# EAGLE design sensor_board_v0.55 (EAGLE 8.1.1)
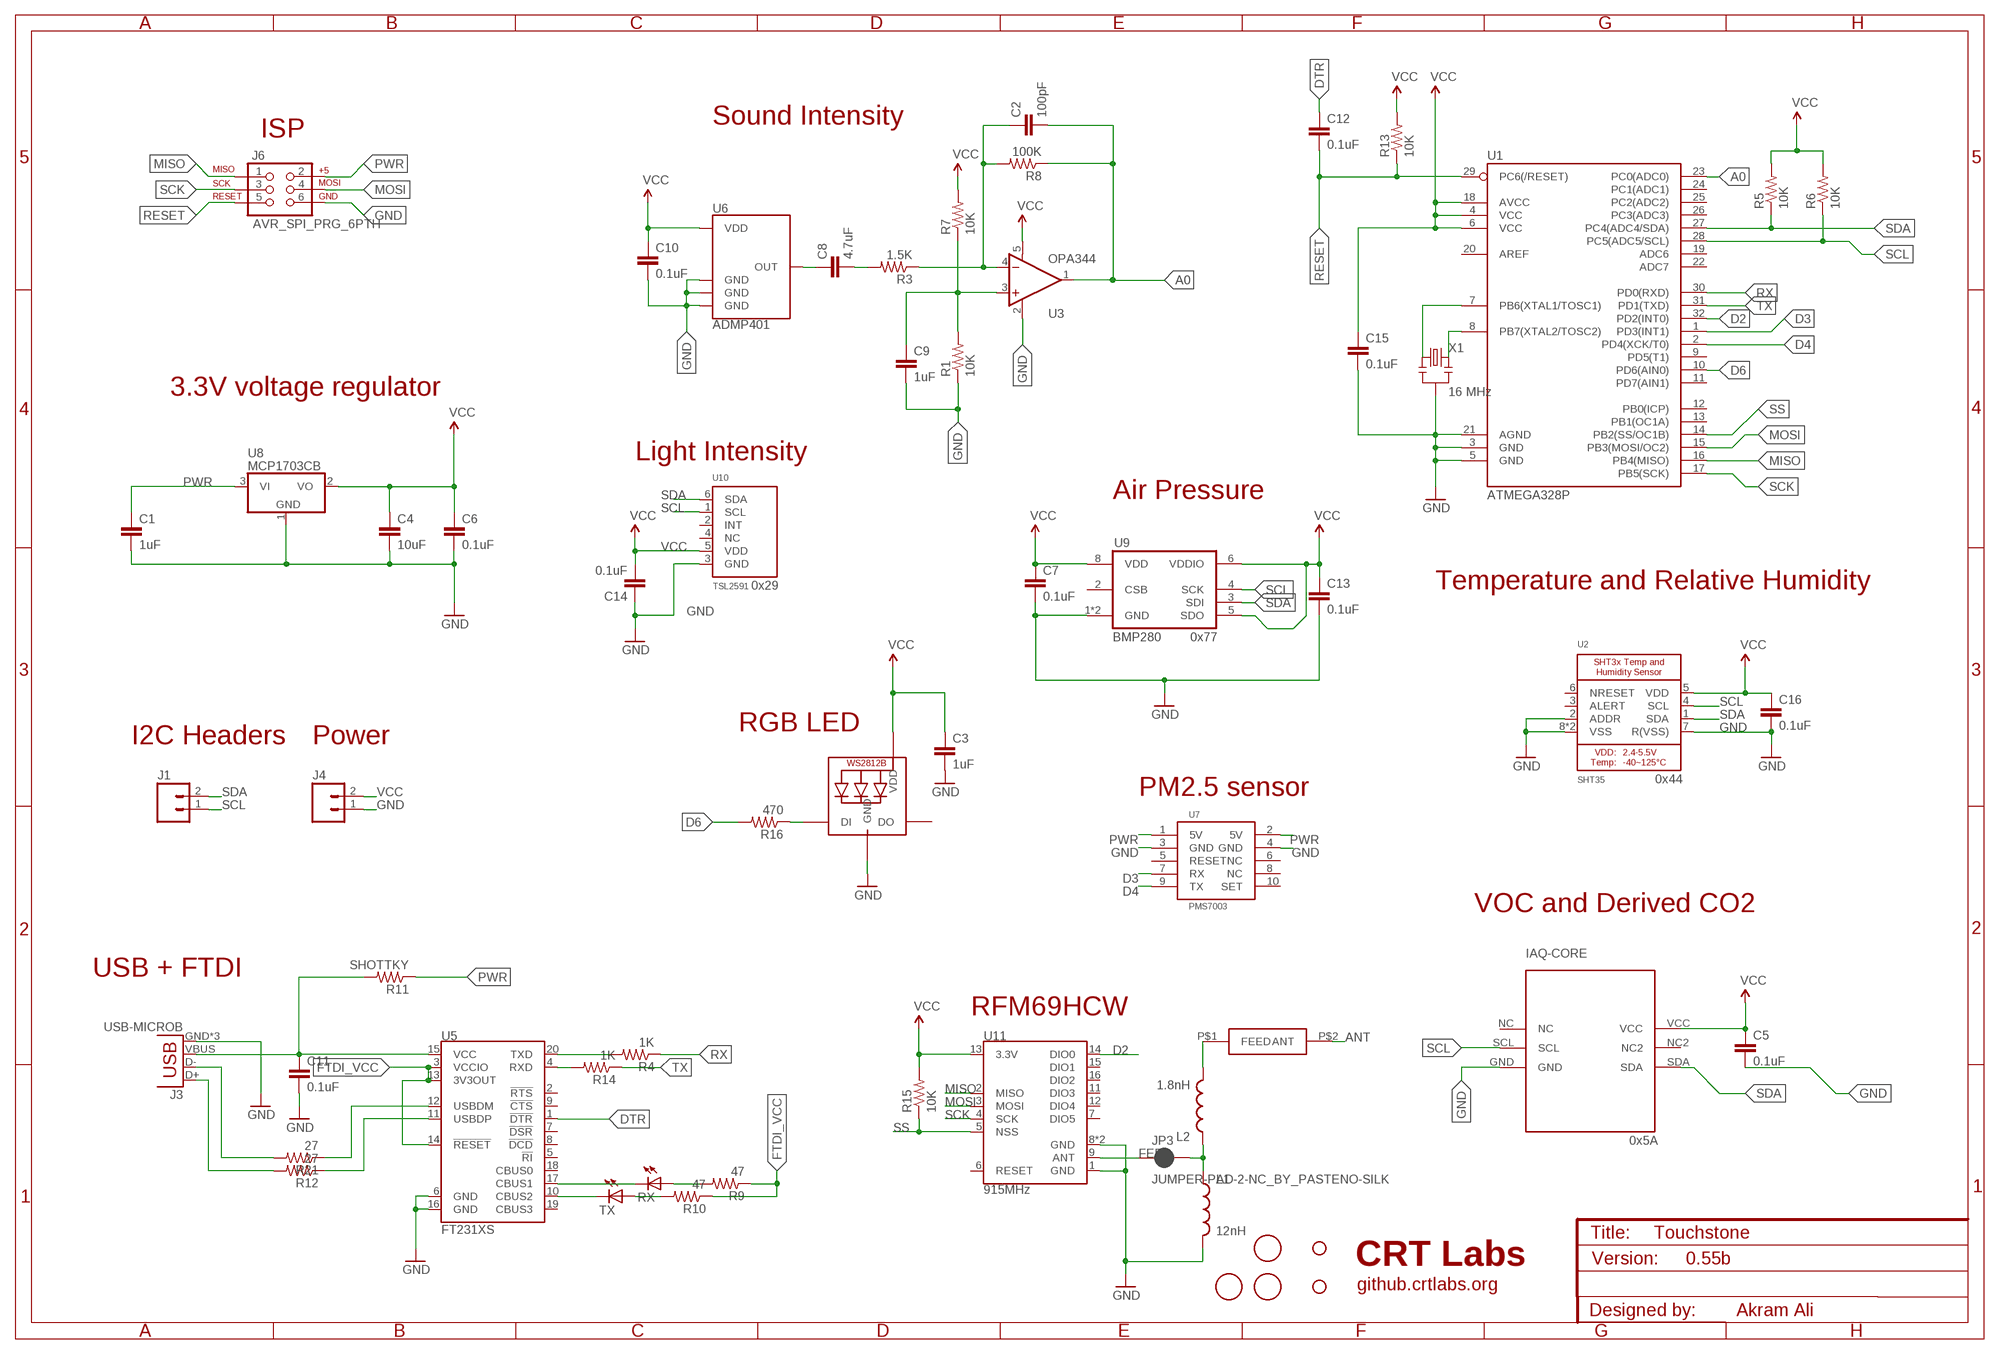
[diagram p0: schematic, sheet 1]

## Parts
C1  1uF  CAP0805  [0805]
C2  100pF  CAP0805  [0805]
C3  1uF  CAP0805  [0805]
C4  10uF  CAP0805  [0805]
C5  0.1uF  CAP0805  [0805]
C6  0.1uF  CAP0805  [0805]
C7  0.1uF  CAP0805  [0805]
C8  4.7uF  CAP0805  [0805]
C9  1uF  CAP0805  [0805]
C10  0.1uF  CAP0805  [0805]
C11  0.1uF  CAP0805  [0805]
C12  0.1uF  CAP0805  [0805]
C13  0.1uF  CAP0805  [0805]
C14  0.1uF  CAP0805  [0805]
C15  0.1uF  CAP0805  [0805]
C16  0.1uF  CAP0805  [0805]
H1  STAND-OFF  [STAND-OFF]
H2  STAND-OFF  [STAND-OFF]
IAQ-CORE  IAQ-CORE  [IAQ-CORE]
J1  M02PTH  [1X02]
J3  USB-MICROB  [USB-MICROB]
J4  M02PTH  [1X02]
J6  AVR_SPI_PRG_6PTH  [2X3]
JP3  JUMPER-PAD-2-NC_BY_PASTENO-SILK  [PAD-JUMPER-2-NC_BY_PASTE_NO_SILK]
L1  12nH  INDUCTOR0805-IND  [0805]
L2  1.8nH  INDUCTOR0805-IND  [0805]
LED1  WS2812B3535  [LED3535]
R1  10K  RESISTOR0805-RES  [0805]
R3  1.5K  RESISTOR0805-RES  [0805]
R4  1K  RESISTOR0805-RES  [0805]
R5  10K  RESISTOR0805-RES  [0805]
R6  10K  RESISTOR0805-RES  [0805]
R7  10K  RESISTOR0805-RES  [0805]
R8  100K  RESISTOR0805-RES  [0805]
R9  47  RESISTOR0805-RES  [0805]
R10  47  RESISTOR0805-RES  [0805]
R11  SHOTTKY  RESISTOR0805-RES  [0805]
R12  27  RESISTOR0805-RES  [0805]
R13  10K  RESISTOR0805-RES  [0805]
R14  1K  RESISTOR0805-RES  [0805]
R15  10K  RESISTOR0805-RES  [0805]
R16  470  R-US_R0603  [R0603]
R21  27  RESISTOR0805-RES  [0805]
RX  LEDCHIPLED_0805  [CHIPLED_0805]
TX  LEDCHIPLED_0805  [CHIPLED_0805]
U1  ATMEGA328P  ATMEGA328P_TQFP  [TQFP32-08]
U2  SHT35  SHT3X  [SHT3X]
U3  OPA344  [SOT23-5]
U5  FT231XS  [SSOP20_L]
U6  ADMP401  [ADMP401]
U7  PMS7003  [RECEPTACLE_1.27MM]
U8  MCP1703CB  [SOT23]
U9  BMP280  [BMP280]
U10  TSL2591  LIGHT_TSL2591  [DFN6_TAOS]
U11  915MHz  RFM69HCW-915  [RFM69HCW-XXXS2]
U$1  FIDUCIAL  [FIDUCIAL_1MM]
U$2  FIDUCIAL  [FIDUCIAL_1MM]
U$3  FIDUCIAL  [FIDUCIAL_1MM]
U$4  0868AT43A0020E  [SMD_CHIP]
X1  16 MHz  RESONATORSMD  [RESONATOR-SMD]

## Nets
A0: C2.2 R8.1 U1.23(PC0(ADC0)) U3.1(OUT)
ANT: U$4.P$2(ANT)
D2: U1.32(PD2(INT0)) U11.14(DIO0)
D3: U1.1(PD3(INT1)) U7.7(RX)
D4: U1.2(PD4(XCK/T0)) U7.9(TX)
D6: R16.2 U1.10(PD6(AIN0))
DTR: C12.1 U5.1(!DTR)
FEED: JP3.2 L1.1 L2.1
FTDI_VCC: R9.1 R10.1 U5.3(VCCIO) U5.13(3V3OUT) U5.14(!RESET)
GND: C1.2 C3.2 C4.2 C5.2 C6.2 C7.2 C9.2 C10.2 C11.2 C13.2 C14.1 C15.2 C16.2 IAQ-CORE.GND J3.GND J3.MT1(GND) J3.MT2(GND) J4.1 J6.6 L1.2 LED1.4(GND) R1.1 U1.3(GND) U1.5(GND) U1.21(AGND) U2.2(ADDR) U2.7(R(VSS)) U2.8(VSS) U2.THERMAL(VSS) U3.2(V-) U5.6(GND) U5.16(GND) U6.2(GND) U6.4(GND) U6.6(GND) U7.3(GND) U7.4(GND) U8.1(GND) U9.1(GND) U9.7(GND) U10.3(GND) U11.1(GND) U11.8(GND) U11.10(GND) X1.2
MISO: J6.1 U1.16(PB4(MISO)) U11.2(MISO)
MOSI: J6.4 U1.15(PB3(MOSI/OC2)) U11.3(MOSI)
N$1: L2.2 U$4.P$1(FEED)
N$2: R14.2 U5.4(RXD)
N$3: R4.2 U5.20(TXD)
N$4: U1.8(PB7(XTAL2/TOSC2)) X1.3
N$5: U1.7(PB6(XTAL1/TOSC1)) X1.1
N$6: JP3.1 U11.9(ANT)
N$7: LED1.1(DI) R16.1
N$9: C8.2 R3.2
N$10: C2.1 R3.1 R8.2 U3.4(-IN)
N$11: C9.1 R1.2 R7.1 U3.3(+IN)
N$17: RX.C U5.17(CBUS1)
N$18: TX.C U5.10(CBUS2)
N$25: R21.1 U5.12(USBDM)
N$26: R12.1 U5.11(USBDP)
N$27: R9.2 RX.A
N$29: R10.2 TX.A
N$32: J3.D- R21.2
N$33: J3.D+ R12.2
OUT: C8.1 U6.1(OUT)
PWR: C1.1 J6.2 R11.1 U7.1(5V) U7.2(5V) U8.3(VI)
RESET: C12.2 J6.5 R13.1 U1.29(PC6(/RESET))
RX: R4.1 U1.30(PD0(RXD))
SCK: J6.3 U1.17(PB5(SCK)) U11.4(SCK)
SCL: IAQ-CORE.SCL J1.1 R6.1 U1.28(PC5(ADC5/SCL)) U2.4(SCL) U9.4(SCK) U10.1(SCL)
SDA: IAQ-CORE.SDA J1.2 R5.1 U1.27(PC4(ADC4/SDA)) U2.1(SDA) U9.3(SDI) U10.6(SDA)
SS: R15.1 U1.14(PB2(SS/OC1B)) U11.5(NSS)
TX: R14.1 U1.31(PD1(TXD))
VBUS: C11.1 J3.VBUS R11.2 U5.15(VCC)
VCC: C3.1 C4.1 C5.1 C6.1 C7.1 C10.1 C13.1 C14.2 C15.1 C16.1 IAQ-CORE.VCC J4.2 LED1.2(VDD) R5.2 R6.2 R7.2 R13.2 R15.2 U1.4(VCC) U1.6(VCC) U1.18(AVCC) U2.5(VDD) U3.5(V+) U6.5(VDD) U8.2(VO) U9.5(SDO) U9.6(VDDIO) U9.8(VDD) U10.5(VDD) U11.13(3.3V)
Unconnected: IAQ-CORE.NC IAQ-CORE.NC2 LED1.3(DO) U1.9(PD5(T1)) U1.11(PD7(AIN1)) U1.12(PB0(ICP)) U1.13(PB1(OC1A)) U1.19(ADC6) U1.20(AREF) U1.22(ADC7) U1.24(PC1(ADC1)) U1.25(PC2(ADC2)) U1.26(PC3(ADC3)) U2.3(ALERT) U2.6(NRESET) U5.2(!RTS) U5.5(!RI) U5.7(!DSR) U5.8(!DCD) U5.9(!CTS) U5.18(CBUS0) U5.19(CBUS3) U7.5(RESET) U7.6(NC) U7.8(NC) U7.10(SET) U9.2(CSB) U10.2(INT) U10.4(NC) U11.6(RESET) U11.7(DIO5) U11.11(DIO3) U11.12(DIO4) U11.15(DIO1) U11.16(DIO2)

## Notes on the sheet
- Sound Intensity
- ISP
- 3.3V voltage regulator
- Light Intensity
- Air Pressure
- 0x29 | Temperature and Relative Humidity
- 0x77
- RGB LED
- I2C Headers | Power
- 0x44
- PM2.5 sensor
- VOC and Derived CO2
- USB + FTDI
- RFM69HCW
- 0x5A
- Touchstone
- CRT Labs | 0.55b
- github.crtlabs.org
- Akram Ali

## Library data of the parts
C1 C3 C9 = SparkFun-Capacitors:CAP: Capacitor Standard 0603 ceramic capacitor, and 0.1" leaded capacitor.; MPN: CC0805ZRY5V8BB105
C2 = SparkFun-Capacitors:CAP: Capacitor Standard 0603 ceramic capacitor, and 0.1" leaded capacitor.; MPN: CC0805JRNPOABN101
C4 = SparkFun-Capacitors:CAP: Capacitor Standard 0603 ceramic capacitor, and 0.1" leaded capacitor.; MPN: CC0805KKX5R6BB106
C5 C7 C12-C16 = SparkFun-Passives:CAP: Capacitor Standard 0603 ceramic capacitor, and 0.1" leaded capacitor.; MPN: CC0805KRX7R9BB104
C6 C10 C11 = SparkFun-Capacitors:CAP: Capacitor Standard 0603 ceramic capacitor, and 0.1" leaded capacitor.; MPN: CC0805KRX7R9BB104
C8 = SparkFun-Capacitors:CAP: Capacitor Standard 0603 ceramic capacitor, and 0.1" leaded capacitor.; MPN: CC0805KKX7R6BB475
H1 H2 = SparkFun-Electromechanical:STAND-OFF: #4 Stand Off This is the mechanical footprint for a #4 phillips button head screw. Use the keepout ring to avoid running the screw head into surrounding components. SKU : PRT-00447
IAQ-CORE = IAQ-CORE:IAQ-CORE; MPN: IAQ-CORE C; OC_NEWARK: 82Y5455
J1 J4 = SparkFun-Connectors:M02: Standard 2-pin 0.1" header. Use with - straight break away headers ( PRT-00116) - right angle break away headers (PRT-00553) - swiss pins (PRT-00743) - machine pins (PRT-00117) - female headers (PRT-00115) Molex polarized connector foot print use with: PRT-08233 with associated crimp pins and housings. 2.54_SCREWTERM for use with PRT-10571. 3.5mm Screw Terminal footprints for PRT-08084 5mm Screw Terminal footprints for use with PRT-08432
J3 = SparkFun-Connectors:USB: USB Connectors USB-B-PTH is fully proven SKU : PRT-00139/CONN-08278 USB-miniB is fully proven SKU : PRT-00587 USB-A-PCB is untested. USB-A-H is throughly reviewed, but untested. Spark Fun Electronics SKU : PRT-00437 USB-B-SMT is throughly reviewed, but untested. Needs silkscreen touching up. USB-A-S has not been used/tested USB-MB-H has not been used/tested USB-MICROB has been used. CONN-09505; MPN: 47346-0001; PROD_ID: CONN-09505
J6 = SparkFun-Connectors:AVR_SPI_PRG_6: AVR ISP 6 Pin This is the reduced ISP connector for AVR programming. Common on Arduino. This footprint will take up less PCB space and can be used with a 10-pin to 6-pin adapter such as SKU: BOB-08508 **Special note about "TEST_POINT" package. The stop mask is on the top side, so if you want your programming test points to be on the bottom of your board, make sure to place this package on the bottom side of the board. This also ensure that the orientation to program from the bottom side will be correct.
JP3 = SparkFun-Passives:JUMPER-PAD-2-NC_BY_PASTE
L1 L2 = SparkFun-Passives:INDUCTOR: Inductors Basic Inductor/Choke - 0603 and 1206. Footprints are not proven and vary greatly between part numbers. INDUCTOR POWER 3.3UH 4.0A SMD 0.197" L x 0.197" W x 0.177" H (5.00mm x 5.00mm x 4.50mm); PROD_ID: NDUC-13076
LED1 = adafruit:WS2812B; MPN: SK6812 mini
R1 R7 R13 R15 = SparkFun-Passives:RESISTOR: Resistor Basic schematic elements and footprints for 0603, 1206, and PTH resistors.; MPN: RC0805FR-0710KL
R3 = SparkFun-Passives:RESISTOR: Resistor Basic schematic elements and footprints for 0603, 1206, and PTH resistors.; MPN: RC0805FR-071K5L
R4 R14 = SparkFun-Passives:RESISTOR: Resistor Basic schematic elements and footprints for 0603, 1206, and PTH resistors.; MPN: RC0805FR-071KL
R5 R6 = SparkFun-Resistors:RESISTOR: Resistor Basic schematic elements and footprints for 0603, 1206, and PTH resistors.; MPN: RC0805FR-0710KL
R8 = SparkFun-Passives:RESISTOR: Resistor Basic schematic elements and footprints for 0603, 1206, and PTH resistors.; MPN: RC0805FR-07100KL
R9 R10 = SparkFun-Passives:RESISTOR: Resistor Basic schematic elements and footprints for 0603, 1206, and PTH resistors.; MPN: RC0805FR-0747RL
R11 = SparkFun-Passives:RESISTOR: Resistor Basic schematic elements and footprints for 0603, 1206, and PTH resistors.; MPN: SD0805S040S0R5; OC_NEWARK: unknown
R12 R21 = SparkFun-Passives:RESISTOR: Resistor Basic schematic elements and footprints for 0603, 1206, and PTH resistors.; MPN: RC0805FR-0727RL
R16 = adafruit:R-US_: RESISTOR, American symbol; MPN: RC0805FR-07470RL
RX TX = adafruit:LED: LED OSRAM: - CHIPLED LG R971, LG N971, LY N971, LG Q971, LY Q971, LO R971, LY R971 LH N974, LH R974 LS Q976, LO Q976, LY Q976 LO Q996 - Hyper CHIPLED LW Q18S LB Q993, LB Q99A, LB R99A - SideLED LS A670, LO A670, LY A670, LG A670, LP A670 LB A673, LV A673, LT A673, LW A673 LH A674 LY A675 LS A676, LA A676, LO A676, LY A676, LW A676 LS A679, LY A679, LG A679 - Hyper Micro SIDELED® LS Y876, LA Y876, LO Y876, LY Y876 LT Y87S - SmartLED LW L88C, LW L88S LB L89C, LB L89S, LG L890 LS L89K, LO L89K, LY L89K LS L896, LA L896, LO L896, LY L896 - TOPLED LS T670, LO T670, LY T670, LG T670, LP T670 LSG T670, LSP T670, LSY T670, LOP T670, LYG T670 LG T671, LOG T671, LSG T671 LB T673, LV T673, LT T673, LW T673 LH T674 LS T676, LA T676, LO T676, LY T676, LB T676, LH T676, LSB T676, LW T676 LB T67C, LV T67C, LT T67C, LS T67K, LO T67K, LY T67K, LW E67C LS E67B, LA E67B, LO E67B, LY E67B, LB E67C, LV E67C, LT E67C LW T67C LS T679, LY T679, LG T679 LS T770, LO T770, LY T770, LG T770, LP T770 LB T773, LV T773, LT T773, LW T773 LH T774 LS E675, LA E675, LY E675, LS T675 LS T776, LA T776, LO T776, LY T776, LB T776 LHGB T686 LT T68C, LB T68C - Hyper Mini TOPLED® LB M676 - Mini TOPLED Santana® LG M470 LS M47K, LO M47K, LY M47K Source: http://www.osram.convergy.de/; MPN: LG R971-KN-1; OC_NEWARK: unknown
U1 = SparkFun-DigitalIC:ATMEGA328P_TQFP; MPN: ATMEGA328PB-AU; OC_NEWARK: 58Y6083; PROD_ID: IC-09069; VALUE: ATMEGA328P_TQFP
U2 = Adafruit SHT31:SHT3X: SHT3x - Digital Temperature and Humidity Sensor Supply Voltage: 2.4-5.5V Humidity Accuracy: SHT30 = +/-3%RH, SHT31 = +/-2%RH Temperature Sensor: -40~125°C (+/-0.3°C from 10-55C); MPN: SHT35-DIS-B
U3 = SparkFun-AnalogIC:OPA344: Single gate rail-to-rail output op-amp. Inputs extend 300mV past rails.; MPN: OPA344NA/3K; PROD_ID: IC-08251
U5 = SparkFun-DigitalIC:FT231X: FTDI FT231X Full Speed USB to Full-handshake UART This USB2.0 Full Speed IC offers a compact bridge to full handshake UART interfaces. The device is a UART, capable of operating up to 3MBaud, with low power consumption (8mA). The FT231X includes the complete FT-X series feature set and enables USB to be added into a system design quickly and easily over a UART interface.; MPN: FT231XQ-R; PROD_ID: IC-11524
U6 = SparkFun-Sensors:ADMP401: Omnidirection bottom-port MEMS microphone; MPN: INMP401ACEZ-R7
U7 = Amphenol:PMS7003: 2x5 header 1.27mm pitch This is a library for Amphenol FCI 2x5 header with 1.27mm pitch used on Plant Tower's PMS7003 PM2.5 laser sensor. MPN: 20021311-00010T4LF Datasheet: http://www.mouser.com/ds/2/18/20021311-974469.pdf Designed by Akram Ali https://github.com/AKstudios
U8 = linear:MCP1703: 250 mA, 16V, Low Quiescent Current LDO Regulator Source: http://ww1.microchip.com/downloads/en/DeviceDoc/22049b.pdf; MPN: MCP1703T-2502E/CB; OC_NEWARK: 18T9177
U9 = bosch-bmp280:BMP280: The BMP280 is an absolute barometric pressure sensor especially designed for mobile applications. The sensor module is housed in an extremely compact 8-pin metal-lid LGA package with a footprint of only 2.0 × 2.5 mm2 and 0.95 mm package height. Its small dimensions and its low power consumption of 2.7 μA @1Hz allow the implementation in battery driven devices such as mobile phones, GPS modules or watches. The library has been designed by Richard Magdycz <https://www.facebook.com/groups/eaglecadsoftUK>; MPN: BMP280
U10 = TSL2591:LIGHT_TSL2591: TSL2591 Light-To-Digital Sensor; MPN: TSL25911FN
U11 = SparkFun-RF:RFM69H: Hope RF RFM69H ISM Transceiver Module The RFM69H is a transceiver module capable of operation over a wide frequency range, including the 315,433,868 and 915MHz license-free ISM (Industry Scientific and Medical) frequency bands. All major RF communication parameters are programmable and most of them can be dynamically set. The RFM69H offers the unique advantage of programmable narrow-band and wide- band communication modes. The RFM69H is optimized for low power consumption while offering high RF output power and channelized operation.Compliance ETSI and FCC regulations. Datasheet <http://www.hoperf.cn/upload/docs/RF/SX/RFM69H_DataSheet_v1.3.pdf> SparkFun Products RFM69HCW Wireless Transceiver - 915MHz <https://www.sparkfun.com/products/13909> (COM-13909) RFM69HCW Wireless Transceiver - 434MHz <https://www.sparkfun.com/products/13910> (COM-13910) SparkFun RFM69 Breakout (915MHz) <https://www.sparkfun.com/products/12775> (WRL-12775) SparkFun RFM69 Breakout (434MHz) <https://www.sparkfun.com/products/12823> (WRL-12823); PROD_ID: IC-11997
U$1-U$3 = adafruit:FIDUCIAL: For use by pick and place machines to calibrate the vision/machine, 1mm By microbuilder.eu
U$4 = johanson-technology:0868AT43A0020E
X1 = SparkFun:RESONATOR: Resonator Small SMD resonator. This is the itty bitty 10/20MHz resonators with built in caps. CSTCE10M0G55 and CSTCE20M0V53. Footprint has been reviewed closely but hasn't been tested yet.

## Net classes
1 power: width 0.381 mm, clearance 0.254 mm

## Board
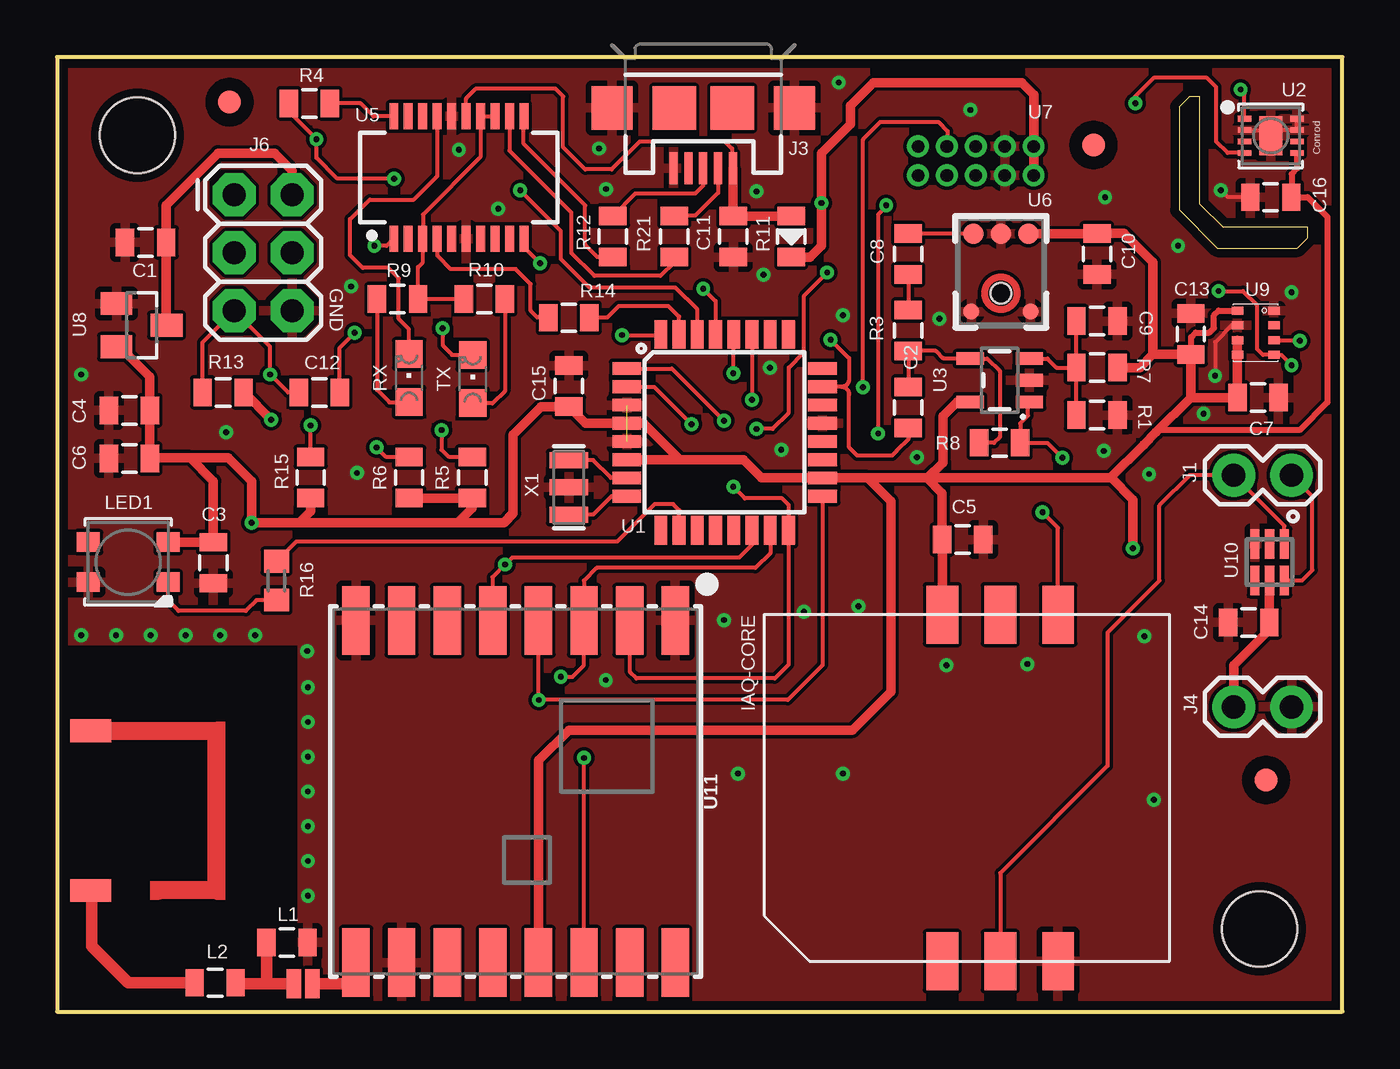
[diagram p1: board, top side]
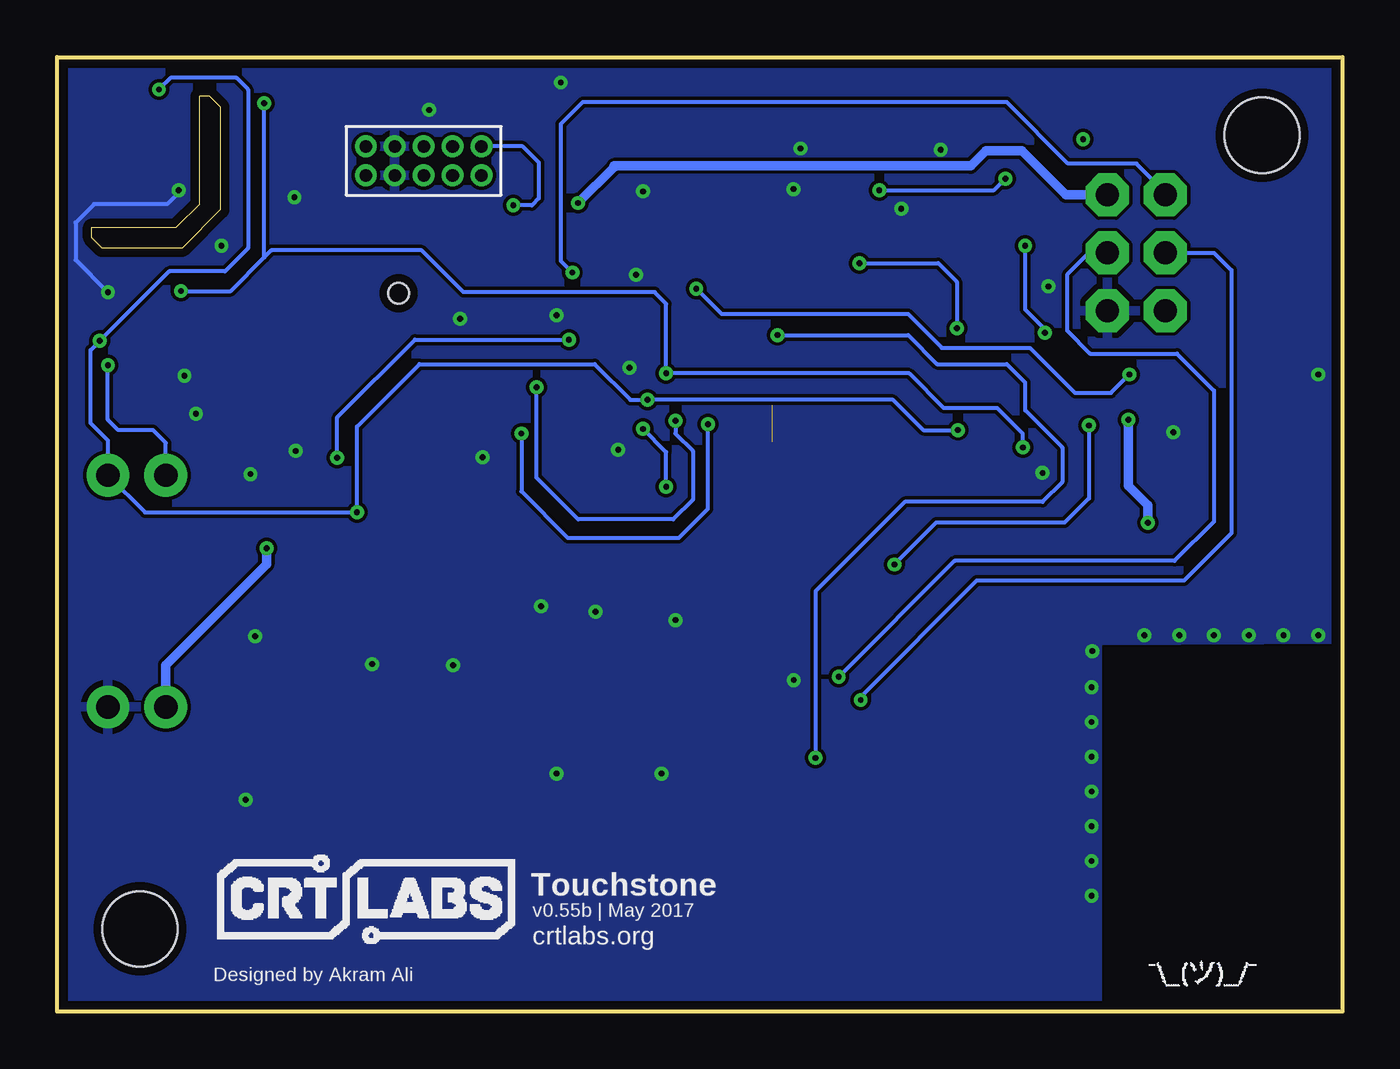
[diagram p2: board, bottom side, seen from below]

Size 56.39 x 41.86 mm. Coordinates in mm from the lower left corner, seen from the top.
Outline: 50.14,35.4 50.14,40.13 49.68,40.13 49.23,39.67 49.23,35.15 50.9,33.47 54.41,33.47 54.86,33.93 54.86,34.39 51.16,34.39 50.14,35.4
Outline: 0,41.86 0,0 56.39,0 56.39,41.86 0,41.86
Copper layers (1*16): Top 0.0356mm / dielectric 1.5011mm / Bottom 0.0356mm
Design rules "oshpark-2layer": minimum track width 6mil, minimum drill 13mil, track to track 6mil, track to pad 6mil, pad to pad 6mil, via to via 6mil, smd to smd 6mil, copper to edge 15mil, drill to drill 6mil, minimum pad ring 7mil, minimum via ring 7mil, stop-mask expansion 2.5mil, vias tented up to drill 0mil, thermal gap 10mil

### Footprints (pad centres in the part's own frame; a part is rotated, then mirrored left to right if it is on the bottom)
0805 = smd 0.8 x 1.2: 1 -0.9,0; 2 0.9,0
STAND-OFF = hole 3.302: 0,0
IAQ-CORE = smd 2.54 x 1.4: GND 0,-12.9; NC 0,-7.82; NC2 15.2,-10.36; SCL 0,-10.36; SDA 15.2,-12.9; VCC 15.2,-7.82
1X02 = drill 1.016 pad 1.88: 1 0,0; 2 2.54,0
USB-MICROB = smd 0.35 x 1.4: D+ 0,2.65; D- -0.65,2.65; GND 1.3,2.65; ID 0.65,2.65; VBUS -1.3,2.65 | smd 1.8 x 1.9: MT1 -4,0; MT2 4,0 | smd 1.9 x 1.9: P$1 -1.27,0; P$2 1.27,0
2X3 = drill 1.016 pad 1.88 octagon: 1 0,0; 2 0,2.54; 3 2.54,0; 4 2.54,2.54; 5 5.08,0; 6 5.08,2.54
PAD-JUMPER-2-NC_BY_PASTE_NO_SILK = smd 0.635 x 1.27: 1 -0.401,0; 2 0.413,0
LED3535 = smd 1 x 0.85: 1 -1.75,0.875; 2 -1.75,-0.875; 3 1.75,-0.875; 4 1.75,0.875
R0603 = smd 1 x 1.1: 1 -0.85,0; 2 0.85,0
CHIPLED_0805 = smd 1.2 x 1.2: A 0,-1.05; C 0,1.05
TQFP32-08 = smd 1.27 x 0.559: 1 -4.293,2.8; 2 -4.293,2; 3 -4.293,1.2; 4 -4.293,0.4; 5 -4.293,-0.4; 6 -4.293,-1.2; 7 -4.293,-2; 8 -4.293,-2.8; 17 4.293,-2.8; 18 4.293,-2; 19 4.293,-1.2; 20 4.293,-0.4; 21 4.293,0.4; 22 4.293,1.2; 23 4.293,2; 24 4.293,2.8 | smd 0.559 x 1.27: 9 -2.8,-4.293; 10 -2,-4.293; 11 -1.2,-4.293; 12 -0.4,-4.293; 13 0.4,-4.293; 14 1.2,-4.293; 15 2,-4.293; 16 2.8,-4.293; 25 2.8,4.293; 26 2,4.293; 27 1.2,4.293; 28 0.4,4.293; 29 -0.4,4.293; 30 -1.2,4.293; 31 -2,4.293; 32 -2.8,4.293
SHT3X = smd 0.6 x 0.25: 1 -1.15,0.75; 2 -1.15,0.25; 3 -1.15,-0.25; 4 -1.15,-0.75; 5 1.15,-0.75; 6 1.15,-0.25; 7 1.15,0.25; 8 1.15,0.75 | smd 1 x 1.7: THERMAL 0,0
SOT23-5 = smd 0.55 x 1.2: 1 -0.95,-1.3; 2 0,-1.3; 3 0.95,-1.3; 4 0.95,1.3; 5 -0.95,1.3
SSOP20_L = smd 0.381 x 1.143: 1 -2.857,-2.68; 2 -2.223,-2.68; 3 -1.587,-2.68; 4 -0.953,-2.68; 5 -0.318,-2.68; 6 0.318,-2.68; 7 0.953,-2.68; 8 1.587,-2.68; 9 2.223,-2.68; 10 2.857,-2.68; 11 2.857,2.68; 12 2.223,2.68; 13 1.587,2.68; 14 0.953,2.68; 15 0.318,2.68; 16 -0.318,2.68; 17 -0.953,2.68; 18 -1.587,2.68; 19 -2.223,2.68; 20 -2.857,2.68
ADMP401 = smd 0.9 x 0.9: 1 -1.2,2.62; 5 1.2,2.62; 6 0,2.62 | smd 0.7 x 0.7: 2 1.3,-0.8; 4 -1.3,-0.8 | hole 0.9: 0,0
RECEPTACLE_1.27MM = drill 0.55 pad 0.95: 1 3.865,3.865; 2 5.135,3.865; 3 3.865,5.135; 4 5.135,5.135; 5 3.865,6.405; 6 5.135,6.405; 7 3.865,7.675; 8 5.135,7.675; 9 3.865,8.945; 10 5.135,8.945
SOT23 = smd 1 x 1.4: 1 -0.95,-1.1; 2 0.95,-1.1; 3 0,1.1
BMP280 = smd 0.35 x 0.5: 1 0.975,-0.8; 2 0.325,-0.8; 3 -0.325,-0.8; 4 -0.975,-0.8; 5 -0.975,0.8; 6 -0.325,0.8; 7 0.325,0.8; 8 0.975,0.8
DFN6_TAOS = smd 1.3 x 0.4: 1 -0.8,0.65; 2 -0.8,0; 3 -0.8,-0.65; 4 0.8,-0.65; 5 0.8,0; 6 0.8,0.65
RFM69HCW-XXXS2 = smd 3 x 1.2: 1 -7.5,7; 2 -7.5,5; 3 -7.5,3; 4 -7.5,1; 5 -7.5,-1; 6 -7.5,-3; 7 -7.5,-5; 8 -7.5,-7; 9 7.5,-7; 10 7.5,-5; 11 7.5,-3; 12 7.5,-1; 13 7.5,1; 14 7.5,3; 15 7.5,5; 16 7.5,7
FIDUCIAL_1MM = smd 1 x 1: 1 0,0
SMD_CHIP = smd 1 x 1.8: P$1 0,0; P$2 7,0
RESONATOR-SMD = smd 0.7 x 1.7: 1 -1.2,0; 2 0,0; 3 1.2,0

### Placement (x,y rotation side)
C1  3.89,33.73 180 top
C2  37.34,26.49 270 top
C3  6.86,19.68 270 top
C4  3.17,26.36 180 top
C5  39.73,20.7 0 top
C6  3.17,24.25 180 top
C7  52.68,26.92 0 top
C8  37.34,33.22 270 top
C9  45.62,30.27 0 top
C10  45.62,33.22 270 top
C11  29.67,33.98 270 top
C12  11.51,27.15 180 top
C13  49.73,29.71 90 top
C14  52.27,17.07 0 top
C15  22.45,27.43 90 top
C16  53.24,35.71 180 top
H1  3.53,38.43 0 top
H2  52.76,3.63 0 top
IAQ-CORE  31.01,2.21 90 top
J1  51.61,23.52 0 top
J3  28.35,39.62 180 top
J4  54.15,13.36 180 top
J6  7.77,35.81 270 top
JP3  10.79,1.22 180 top
L1  10.09,3.03 0 top
L2  6.94,1.26 180 top
LED1  3.12,19.71 180 top
R1  45.62,26.16 180 top
R3  37.34,29.87 90 top
R4  11.07,39.82 0 top
R5  18.21,23.42 270 top
R6  15.44,23.42 270 top
R7  45.62,28.24 0 top
R8  41.35,24.94 180 top
R9  14.94,31.24 180 top
R10  18.75,31.24 0 top
R11  32.21,33.98 90 top
R12  24.38,33.98 90 top
R13  7.29,27.15 0 top
R14  22.45,30.43 180 top
R15  11.13,23.42 270 top
R16  9.63,18.89 90 top
R21  27.08,33.98 90 top
RX  15.44,27.78 0 top
TX  18.24,27.73 0 top
U1  29.29,25.4 0 top
U2  53.24,38.4 0 top
U3  41.35,27.68 90 top
U5  17.63,36.57 0 top
U6  41.4,31.49 0 top
U7  46.71,41.81 270 bottom
U8  3.71,30.1 270 top
U9  52.58,29.77 90 top
U10  53.19,19.71 270 top
U11  20.12,9.65 270 top
U$1  7.57,39.87 0 top
U$2  53.04,10.16 0 top
U$3  45.47,38 0 top
U$4  1.48,5.31 90 top
X1  22.45,22.98 270 top

### Tracks (layer width: path | path; a pad name or v marks a point on that pad's centre or on a via)
A0  (via drill 0.25 pad 0.13)
  Top 0.178: 37.15,25.59 C2.2 37.34,25.1 36.84,24.61 36.84,24.6 36.63,24.38 35.1,24.38 34.75,24.74 34.75,27.06 arc90 34.41,27.4 | U3.1 42.6,26.68 42.6,26.13 42.25,25.79 R8.1 43.43,24.94 v44.09,24.28 | 34.41,27.4 U1.23 | v33.93,29.46 34.75,28.65 34.75,27.73 arc-90 34.41,27.4
  Bottom 0.178: v44.09,24.28 44.09,26.06 40.69,29.46 v33.93,29.46
ANT
  Top 0.8: U$4.P$2 6.98,12.31 6.98,5.31 4.48,5.31
D2  (via drill 0.25 pad 0.13)
  Top 0.178: v24.79,29.66 26.46,29.66 U1.32 | U11.14 23.12,5.18 v23.11,11.12
  Bottom 0.178: v24.79,29.66 19.05,29.66 17.78,28.39 14.73,28.39 13.92,27.58 13.92,26.36 12.29,24.74 12.29,23.21 13.16,22.35 19.2,22.35 23.11,18.44 v23.11,11.12
D3  (via drill 0.25 pad 0.13)
  Top 0.178: U1.1 26.97,28.2 v29.26,25.91 | v35.36,27.38 35.36,38.25 36.12,39.01 38.66,39.01 39.07,38.61 39.07,37.97 U7.7
  Bottom 0.178: v29.26,25.91 29.26,25.35 28.5,24.58 28.5,22.45 29.36,21.59 33.53,21.59 35.36,23.42 v35.36,27.38
D4  (via drill 0.25 pad 0.13)
  Top 0.178: U1.2 26.19,27.4 v27.84,25.75 | v36.37,35.35 36.37,35.3 36.02,34.95 v36.02,25.35
  Bottom 0.178: v36.37,35.35 35.56,35.35 35.26,35.66 35.26,37.23 35.96,37.94 U7.9 | v36.02,25.35 36.02,22.81 33.98,20.77 29.11,20.77 27.84,22.04 v27.84,25.75
D6
  Top 0.178: U1.10 27.29,21.99 27.03,22.25 26.21,22.25 24.59,20.62 10.5,20.62 R16.2
DTR  (via drill 0.25 pad 0.13)
  Top 0.178: U5.1 14.45,33.58 v13.92,33.58 | C12.1 12.41,29.12 v13.06,29.77
  Bottom 0.178: v13.92,33.58 13.92,30.78 13.06,29.92 v13.06,29.77
FEED
  Top 0.5: 9.27,1.22 JP3.2 | 9.27,1.22 7.84,1.22 L2.1 | L1.1 9.19,1.3 9.27,1.22
FTDI_VCC
  Top 0.178: U5.13 U5.14 18.58,37.47 16.05,34.95 16.05,33.91 U5.3 16.05,33.88 16.05,32.86 15.83,32.65 R9.1 R10.1
GND  (via drill 0.25 pad 0.13)  (1 unrouted)
  Top 0.178: U2.2 52.99,38.65 U2.THERMAL 53.49,38.65 U2.7 U2.8 | C16.2 51.36,35.71 v51.05,36.01 | U9.7 51.53,30.09 50.8,29.36 v50.8,27.89
  Bottom 0.178: v51.05,36.01 51.05,35.91 51.56,35.4 54.76,35.4 55.58,34.59 55.58,32.97 v54.15,31.54
  other vias: 19.35,35.2 17.63,37.79 49.17,33.58 37.72,24.3 47.9,23.57 45.92,24.58 50.29,26.21 23.77,37.84 24.08,36.06 30.68,35.96 48.11,9.29 35.15,17.78 30.99,32.31 42.57,15.24 45.97,35.71 34.29,40.74 1.07,27.94 7.42,25.4 38.71,30.38 39.01,15.19 47.7,16.46 12.9,31.8 29.26,17.17 13.16,23.62 1.07,16.51 2.59,16.51 4.11,16.51 5.64,16.51 7.16,16.51 8.69,16.51 10.97,15.81 11,14.22 11,12.7 11,11.17 11,9.65 11,8.12 11,6.6 29.87,10.44 34.47,10.44 40.07,39.54 34.47,30.54 31.27,28.24 31.77,24.64 32.77,17.54 24.07,14.54 11,5.08
  pour Top: 0,42.21 56.74,42.21 56.74,-0.16 10.74,0.1 10.74,16.27 -0.3,16.27 -0.3,42.26
  pour Bottom: -0.2,42.06 56.74,42.06 56.74,0 10.74,0.2 10.74,16.27 -0.2,16.32
MISO  (via drill 0.25 pad 0.13)
  Top 0.178: v29.67,23.01 30.17,22.5 31.8,22.5 32.09,22.22 U1.16 32.09,15.21 31.48,14.61 25.41,14.61 25.15,14.88 25.15,17.12 U11.2 | v30.68,25.55 31.39,25.55 32.11,26.26 32.11,28.24 32.77,28.9 32.77,31.39 v33.78,32.41
  Bottom 0.178: v29.67,23.01 29.67,24.53 v30.68,25.55 | J6.1 7.77,35.91 9.04,37.18 12.04,37.18 14.73,39.88 33.33,39.88 34.29,38.91 34.29,32.91 v33.78,32.41
MOSI  (via drill 0.25 pad 0.13)
  Top 0.178: U1.15 31.29,20.11 30.63,19.45 23.67,19.45 23.11,18.89 U11.3 23.11,15.19 22.61,14.68 v22.1,14.68
  Bottom 0.178: 10.31,33.32 J6.4 11.12,33.27 12.09,32.31 12.09,29.87 11.07,28.85 7.26,28.85 5.64,27.23 5.64,21.48 7.37,19.76 17.02,19.76 v22.1,14.68
N$1
  Top 0.5: U$4.P$1 1.52,5.27 1.52,2.87 3.13,1.26 L2.2
N$2
  Top 0.178: U5.4 16.67,33.16 17.27,32.56 20.12,32.56 20.78,31.9 20.78,30.73 21.07,30.44 21.54,30.44 R14.2
N$3
  Top 0.178: U5.20 13.88,39.25 13.31,39.82 R4.2
N$4
  Top 0.178: X1.3 23.52,21.79 24.33,22.6 U1.8
N$5
  Top 0.178: X1.1 23.52,24.18 24.3,23.4 U1.7
N$6
  Top 0.5: JP3.1 13.12,1.22 U11.9
N$7
  Top 0.178: LED1.1 4.87,18.03 5.33,17.57 8.28,17.57 8.75,18.04 R16.1
N$9
  Top 0.178: C8.2 R3.2
N$10
  Top 0.178: C2.1 R3.1 38.54,28.97 38.86,28.65 40.04,28.65 U3.4 40.81,28.63 41.35,28.09 41.35,25.19 41.1,24.94 R8.2
N$11
  Top 0.178: R7.1 C9.1 | U3.3 43.45,28.63 43.84,28.24 R7.1 | R1.2 R7.1
N$17
  Top 0.178: RX.C 15.44,29.92 14.99,30.38 14.99,32.15 14.53,32.61 13.41,32.61 12.85,33.17 12.85,34.74 13.72,35.61 15.65,35.61 16.67,36.64 U5.17
N$18  (via drill 0.25 pad 0.13)
  Top 0.178: U5.10 20.48,33.51 v21.18,32.81 | v16.92,29.97 16.92,29.21 17.32,28.8 18.22,28.8 TX.C
  Bottom 0.178: v21.18,32.81 17.73,32.81 16.92,32 v16.92,29.97
N$25
  Top 0.178: U5.12 19.85,37.75 22.55,35.05 22.55,33.27 23.57,32.26 26.47,32.26 27.08,32.86 R21.1
N$26
  Top 0.178: R12.1 23.71,33.08 23.16,33.63 23.16,35.35 20.47,38.05 20.47,39.24 U5.11
N$27
  Top 0.178: R9.2 14.04,27.26 14.58,26.72 15.43,26.72 RX.A
N$29
  Top 0.178: R10.2 19.65,27.21 19.1,26.67 18.25,26.67 TX.A
N$32
  Top 0.178: J3.D- 29,35.9 27.99,34.9 27.09,34.9 R21.2
N$33
  Top 0.178: J3.D+ 28.35,36.22 27.99,35.86 25.36,35.86 R12.2
OUT
  Top 0.178: U6.1 C8.1
PWR  (via drill 0.25 pad 0.13)
  Top 0.305: 32.22,33.07 R11.1
  Top 0.406: R11.1 33.03,33.08 33.53,33.58 v33.53,35.46 33.53,37.64 34.8,38.91 34.8,39.72 35.81,40.74 42.32,40.74 42.85,40.21 U7.1 U7.2 | J6.2 10.31,36.88 9.55,37.64 7.06,37.64 4.79,35.37 C1.1 4.79,30.12 U8.3
  Bottom 0.406: J6.2 12.14,35.81 14.07,37.74 15.65,37.74 16.31,37.08 31.95,37.08 31.95,37.03 v33.53,35.46
RESET  (via drill 0.25 pad 0.13)
  Top 0.178: v28.35,31.7 28.89,31.16 U1.29 | R13.1 6.39,29.35 J6.5 9.35,29.16 v9.35,27.94 10.13,27.15 C12.2
  Bottom 0.178: v9.35,27.94 10.16,27.12 11.73,27.12 13.72,29.11 17.58,29.11 19.05,30.58 27.23,30.58 v28.35,31.7
RX  (via drill 0.25 pad 0.13)
  Top 0.178: U1.30 28.09,30.79 27.13,31.75 23.37,31.75 22.1,33.02 22.1,34.24 v20.32,36.01 | v14.78,36.52 12.29,36.52 11.38,37.44 v11.38,38.25 10.17,39.45 R4.1
  Bottom 0.178: v20.32,36.01 15.29,36.01 v14.78,36.52
SCK  (via drill 0.25 pad 0.13)
  Top 0.178: U11.4 21.13,17.13 v21.13,13.66 32.05,13.66 33.58,15.19 U1.17
  Bottom 0.178: J6.3 5.64,33.27 4.88,32.51 4.88,20.98 6.96,18.89 16.05,18.89 21.13,13.81 v21.13,13.66
SCL  (via drill 0.25 pad 0.13)
  Top 0.178: R6.1 14.44,24.32 v14.02,24.74 | v29.67,27.99 29.67,29.67 U1.28 | v54.15,28.34 53.7,28.79 U9.4 52.89,28.79 52.63,29.05 52.63,30.98 52.02,31.59 v50.95,31.59 | v47.3,39.82 47.3,40.13 48.11,40.94 50.44,40.94 50.85,40.54 50.85,38.15 51.35,37.65 U2.4 | 46.08,10.87 46.08,16.61 48.36,18.89 48.36,22.2 49.68,23.52 J1.1 53.84,21.29 U10.1 | 46.08,10.87 46.08,10.82 | IAQ-CORE.SCL 41.37,6.07 46.08,10.77 46.08,10.87
  Bottom 0.178: v14.02,24.74 14.02,25.35 15.14,26.46 17.48,26.46 19,27.99 v29.67,27.99 29.67,31.04 30.17,31.54 38.56,31.54 40.39,33.37 46.99,33.37 47.3,33.07 | v50.95,31.59 48.77,31.59 47.3,33.07 | 47.3,33.07 v47.3,39.82 | J1.1 51.61,24.94 52.17,25.5 53.7,25.5 54.15,25.96 v54.15,28.34
SDA  (via drill 0.25 pad 0.13)
  Top 0.178: v16.87,25.5 16.87,24.63 17.17,24.33 18.2,24.33 R5.1 | v54.51,29.41 53.41,29.41 U9.3 | v51.91,40.43 v51.92,40.43 52.09,40.26 U2.1 | U1.27 v30.49,26.83 | v43.23,21.89 43.91,21.21 IAQ-CORE.SDA | J1.2 55.07,22.6 55.07,19.35 54.62,18.91 U10.6
  Bottom 0.178: v16.87,25.5 18.39,25.5 19.72,26.83 v30.49,26.83 | 51.71,40.64 v51.92,40.43 51.41,40.94 48.51,40.94 48.01,40.43 48.01,33.47 49.02,32.46 51.46,32.46 v54.51,29.41 54.91,29 54.91,25.8 54.15,25.04 J1.2 52.53,21.89 v43.23,21.89 43.23,25.65 40.49,28.39 32.8,28.39 31.24,26.83 v30.49,26.83 | v30.49,26.82 v30.49,26.83
SS  (via drill 0.25 pad 0.13)
  Top 0.178: U1.14 30.49,20.48 29.92,19.91 19.96,19.91 v19.66,19.61 19.1,19.05 19.1,17.16 U11.5 | R15.1 v11.12,25.7
  Bottom 0.178: v11.12,25.7 11.12,22.5 12.19,21.43 17.83,21.43 v19.66,19.61
TX
  Top 0.178: U1.31 27.29,30.47 26.82,30.93 24.64,30.93 24.13,30.43 R14.1 23.35,30.49
VBUS
  Top 0.178: U5.15 17.95,40.04 18.39,40.48 21.84,40.48 22.2,40.13 22.2,37.89 23.16,36.93 24.33,36.93 25.55,38.15 29.31,38.15 29.62,37.84 29.62,37 J3.VBUS
  Top 0.305: 29.65,34.9 C11.1
  Top 0.406: J3.VBUS 29.65,34.9 | C11.1 R11.2
VCC  (via drill 0.25 pad 0.13)
  Top 0.254: 49.75,28.8 49.75,29.58 49.94,29.77 50.55,29.77 50.75,29.97 50.75,30.53 50.95,30.73 51.77,30.73 U9.8 | 54.29,35.71 C16.1 | U2.5 54.39,36.96 54.15,36.73 54.15,35.72 C16.1 | 48.11,25.3 47.68,24.86 | C16.1 54.86,35.71 55.73,34.85 55.73,26.72 54.51,25.5 48.31,25.5 48.21,25.4
  Top 0.406: U1.6 27.33,24.2 | 27.33,24.2 30.1,24.2 30.91,23.4 U1.18 35.56,23.4 | 27.33,24.2 25.73,25.8 U1.4 23.18,25.8 C15.1 22.44,26.51 21.23,26.51 20.02,25.3 20.02,21.84 19.61,21.43 17.58,21.43 | 35.56,23.4 38.15,23.4 | 38.15,23.4 46.21,23.4 | 49.73,26.92 C7.1 U9.5 U9.6 | 49.73,26.92 C13.1 | 49.75,28.8 C13.1 | 46.21,23.4 47.68,24.86 48.21,25.4 49.73,26.92 | R6.2 R5.2 18.21,22.07 17.58,21.43 | R13.2 v9.4,25.96 | U3.5 39.49,26.73 38.86,26.11 38.86,24.08 38.18,23.4 38.15,23.4 | U6.5 C10.1 46.8,34.12 48.07,32.85 48.07,28.82 | R7.2 47.5,28.24 48.07,28.82 | 48.07,28.82 C13.1 | 46.21,23.4 46.25,23.4 47.19,22.45 v47.19,20.32 | U8.2 2.75,29.15 4.06,27.84 C4.1 C6.1 4.1,24.28 5.84,24.28 | 5.84,24.28 7.52,24.28 8.53,23.26 v8.53,21.43 10.62,21.43 | 5.84,24.28 6.86,23.26 C3.1 LED1.2 | J4.2 51.61,15.19 53.17,16.75 C14.2 53.19,17.08 U10.5 | 10.62,21.43 17.58,21.43 | R15.2 11.12,21.94 10.62,21.43 | U11.13 21.13,2.17 21.13,11.02 22.45,12.34 34.9,12.34 36.58,14.02 36.58,22.38 35.56,23.4 | IAQ-CORE.VCC 38.83,20.69 C5.1 38.83,22.72 38.15,23.4
  Bottom 0.406: v9.4,25.96 9.4,23.06 8.53,22.2 v8.53,21.43 | v47.19,20.32 47.19,19.61 51.61,15.19 J4.2
(copper drawn outside any net)
  shapes: Top area x3

### Text on the board
_tsilk: U7 | Conrod | GND
_bsilk: Touchstone | v0.55b | May 2017 | crtlabs.org | Designed by Akram Ali